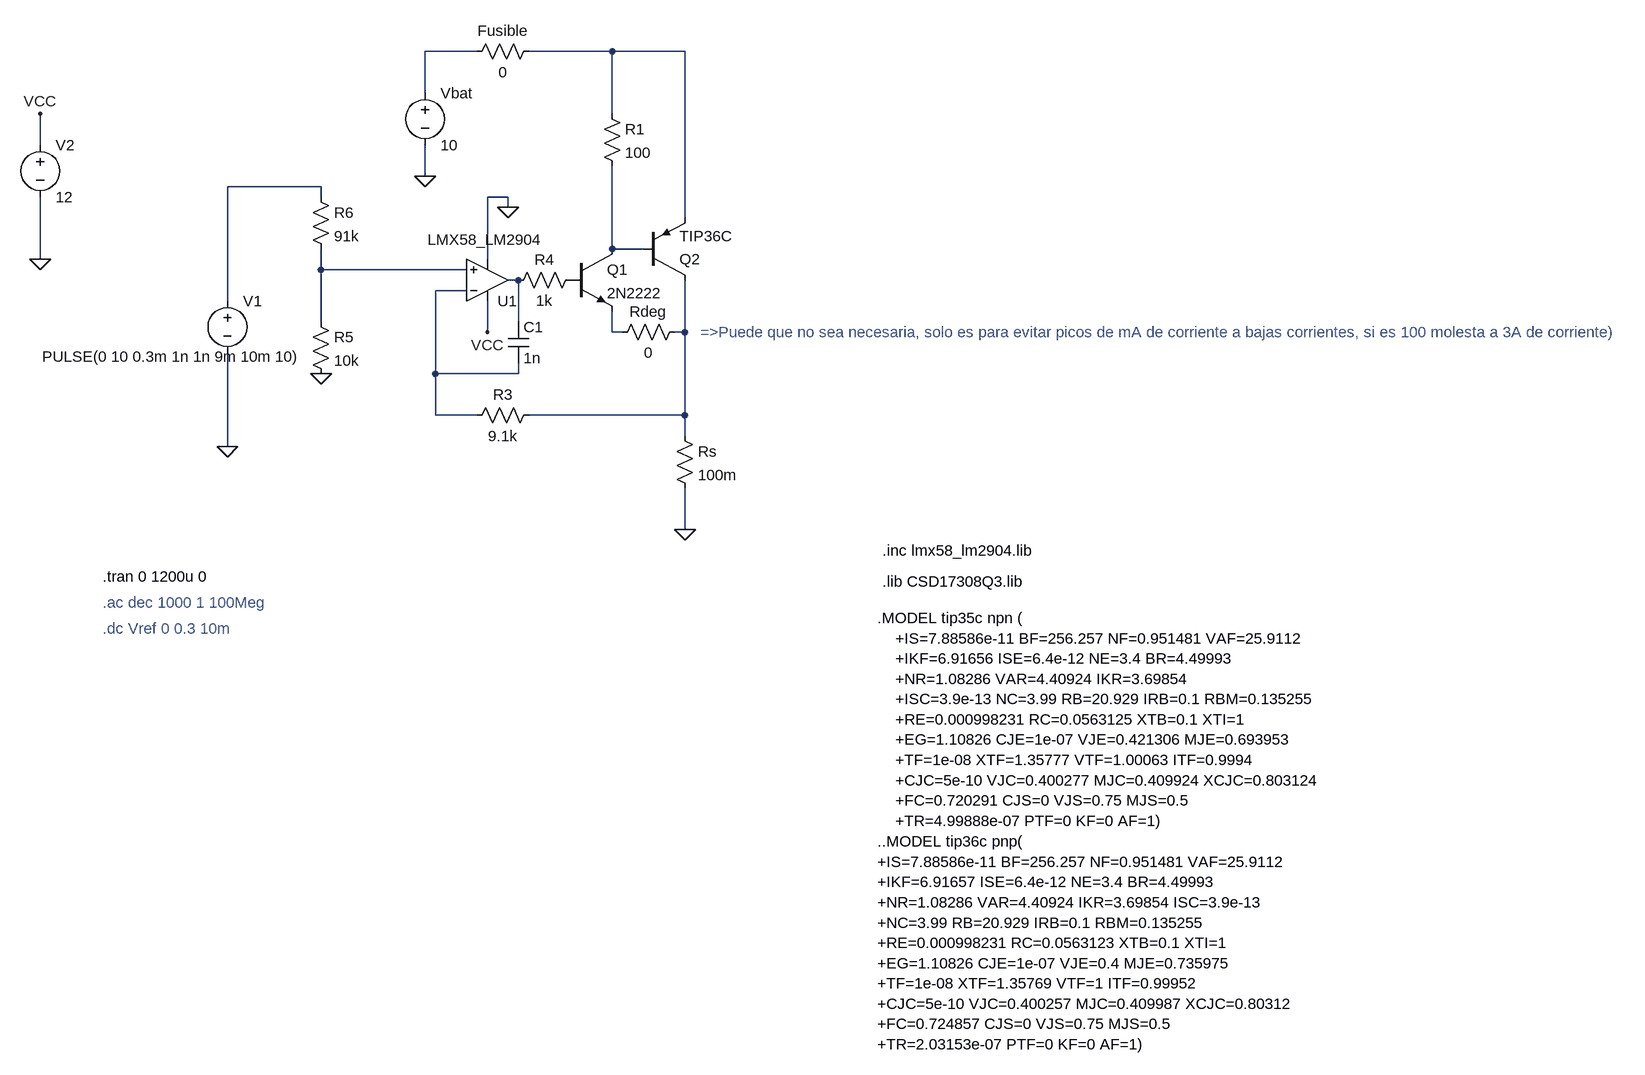
[diagram p0: schematic modulo_descarga_sziklai.asc]
modulo_descarga_sziklai.asc, the LTspice schematic file:
Version 4.1
SHEET 1 2496 680
WIRE 624 -912 544 -912
WIRE 832 -912 704 -912
WIRE 944 -912 832 -912
WIRE 544 -848 544 -912
WIRE 832 -816 832 -912
WIRE -48 -768 -48 -816
WIRE 544 -720 544 -768
WIRE 384 -704 240 -704
WIRE 384 -688 384 -704
WIRE 672 -688 640 -688
WIRE 672 -672 672 -688
WIRE 944 -656 944 -912
WIRE 832 -608 832 -736
WIRE 880 -608 832 -608
WIRE -48 -592 -48 -688
WIRE 640 -592 640 -688
WIRE 384 -576 384 -608
WIRE 608 -576 384 -576
WIRE 688 -560 672 -560
WIRE 608 -544 560 -544
WIRE 240 -528 240 -704
WIRE 384 -496 384 -576
WIRE 688 -496 688 -560
WIRE 640 -480 640 -528
WIRE 832 -480 832 -512
WIRE 848 -480 832 -480
WIRE 944 -480 944 -560
WIRE 944 -480 928 -480
WIRE 560 -416 560 -544
WIRE 688 -416 688 -432
WIRE 688 -416 560 -416
WIRE 560 -352 560 -416
WIRE 624 -352 560 -352
WIRE 944 -352 944 -480
WIRE 944 -352 704 -352
WIRE 944 -320 944 -352
WIRE 240 -304 240 -448
WIRE 944 -176 944 -240
FLAG 944 -176 0
FLAG -48 -816 VCC
FLAG -48 -592 0
FLAG 640 -480 VCC
FLAG 240 -304 0
FLAG 544 -720 0
FLAG 672 -672 0
FLAG 384 -416 0
SYMBOL OpAmps\\opamp2 640 -496 M180
WINDOW 3 -92 126 Left 2
SYMATTR Value LMX58_LM2904
SYMATTR InstName U1
SYMBOL voltage -48 -784 R0
WINDOW 123 0 0 Left 0
WINDOW 39 0 0 Left 0
SYMATTR InstName V2
SYMATTR Value 12
SYMBOL res 928 -336 R0
SYMATTR InstName Rs
SYMATTR Value 100m
SYMBOL voltage 544 -864 R0
WINDOW 123 0 0 Left 0
WINDOW 39 0 0 Left 0
SYMATTR InstName Vbat
SYMATTR Value 10
SYMBOL npn 768 -608 R0
SYMATTR InstName Q1
SYMATTR Value 2N2222
SYMBOL voltage 240 -544 R0
WINDOW 3 -285 102 Left 2
WINDOW 123 0 0 Left 0
WINDOW 39 0 0 Left 0
SYMATTR Value PULSE(0 10 0.3m 1n 1n 9m 10m 10)
SYMATTR InstName V1
SYMBOL pnp 880 -560 M180
SYMATTR InstName Q2
SYMATTR Value TIP36C
SYMBOL res 816 -832 R0
SYMATTR InstName R1
SYMATTR Value 100
SYMBOL res 608 -336 R270
WINDOW 0 32 56 VTop 2
WINDOW 3 0 56 VBottom 2
SYMATTR InstName R3
SYMATTR Value 9.1k
SYMBOL cap 672 -496 R0
SYMATTR InstName C1
SYMATTR Value 1n
SYMBOL res 784 -576 R90
WINDOW 0 0 56 VBottom 2
WINDOW 3 32 56 VTop 2
SYMATTR InstName R4
SYMATTR Value 1k
SYMBOL res 368 -512 R0
SYMATTR InstName R5
SYMATTR Value 10k
SYMBOL res 368 -704 R0
SYMATTR InstName R6
SYMATTR Value 91k
SYMBOL res 720 -928 R90
WINDOW 0 0 56 VBottom 2
WINDOW 3 32 56 VTop 2
SYMATTR InstName Fusible
SYMATTR Value 0
SYMBOL res 944 -496 R90
WINDOW 0 0 56 VBottom 2
WINDOW 3 32 56 VTop 2
SYMATTR InstName Rdeg
SYMATTR Value 0
TEXT 1248 -144 Left 2 !.inc lmx58_lm2904.lib
TEXT 48 -104 Left 2 !.tran 0 1200u 0
TEXT 48 -64 Left 2 ;.ac dec 1000 1 100Meg
TEXT 1248 -96 Left 2 !.lib CSD17308Q3.lib
TEXT 48 -24 Left 2 ;.dc Vref 0 0.3 10m
TEXT 1240 -40 Left 2 !.MODEL tip35c npn (\n    +IS=7.88586e-11 BF=256.257 NF=0.951481 VAF=25.9112\n    +IKF=6.91656 ISE=6.4e-12 NE=3.4 BR=4.49993\n    +NR=1.08286 VAR=4.40924 IKR=3.69854\n    +ISC=3.9e-13 NC=3.99 RB=20.929 IRB=0.1 RBM=0.135255\n    +RE=0.000998231 RC=0.0563125 XTB=0.1 XTI=1\n    +EG=1.10826 CJE=1e-07 VJE=0.421306 MJE=0.693953\n    +TF=1e-08 XTF=1.35777 VTF=1.00063 ITF=0.9994\n    +CJC=5e-10 VJC=0.400277 MJC=0.409924 XCJC=0.803124\n    +FC=0.720291 CJS=0 VJS=0.75 MJS=0.5\n    +TR=4.99888e-07 PTF=0 KF=0 AF=1)
TEXT 1240 304 Left 2 !..MODEL tip36c pnp(\n+IS=7.88586e-11 BF=256.257 NF=0.951481 VAF=25.9112\n+IKF=6.91657 ISE=6.4e-12 NE=3.4 BR=4.49993\n+NR=1.08286 VAR=4.40924 IKR=3.69854 ISC=3.9e-13\n+NC=3.99 RB=20.929 IRB=0.1 RBM=0.135255\n+RE=0.000998231 RC=0.0563123 XTB=0.1 XTI=1\n+EG=1.10826 CJE=1e-07 VJE=0.4 MJE=0.735975\n+TF=1e-08 XTF=1.35769 VTF=1 ITF=0.99952\n+CJC=5e-10 VJC=0.400257 MJC=0.409987 XCJC=0.80312\n+FC=0.724857 CJS=0 VJS=0.75 MJS=0.5\n+TR=2.03153e-07 PTF=0 KF=0 AF=1)
TEXT 968 -480 Left 2 ;=>Puede que no sea necesaria, solo es para evitar picos de mA de corriente a bajas corrientes, si es 100 molesta a 3A de corriente)

The netlist it stands for:
* modulo_descarga_sziklai.asc
X§U1 N005 N007 VCC 0 N006 LMX58_LM2904  ; pins In+ In- V+ V- OUT
V2 VCC 0 12
Rs N009 0 100m
Vbat N001 0 10
Q1 N004 P001 N008 0 2N2222
V1 N003 0 PULSE(0 10 0.3m 1n 1n 9m 10m 10)
Q2 N009 N004 N002 0 TIP36C
R1 N002 N004 100
R3 N007 N009 9.1k
C1 N006 N007 1n
R4 P001 N006 1k
R5 N005 0 10k
R6 N003 N005 91k
R§Fusible N002 N001 0
Rdeg N009 N008 0
.model NPN NPN
.model PNP PNP
.lib standard.bjt
.inc lmx58_lm2904.lib
.tran 0 1200u 0
* .ac dec 1000 1 100Meg
.lib CSD17308Q3.lib
* .dc Vref 0 0.3 10m
.MODEL tip35c npn (
    +IS=7.88586e-11 BF=256.257 NF=0.951481 VAF=25.9112
    +IKF=6.91656 ISE=6.4e-12 NE=3.4 BR=4.49993
    +NR=1.08286 VAR=4.40924 IKR=3.69854
    +ISC=3.9e-13 NC=3.99 RB=20.929 IRB=0.1 RBM=0.135255
    +RE=0.000998231 RC=0.0563125 XTB=0.1 XTI=1
    +EG=1.10826 CJE=1e-07 VJE=0.421306 MJE=0.693953
    +TF=1e-08 XTF=1.35777 VTF=1.00063 ITF=0.9994
    +CJC=5e-10 VJC=0.400277 MJC=0.409924 XCJC=0.803124
    +FC=0.720291 CJS=0 VJS=0.75 MJS=0.5
    +TR=4.99888e-07 PTF=0 KF=0 AF=1)
..MODEL tip36c pnp(
+IS=7.88586e-11 BF=256.257 NF=0.951481 VAF=25.9112
+IKF=6.91657 ISE=6.4e-12 NE=3.4 BR=4.49993
+NR=1.08286 VAR=4.40924 IKR=3.69854 ISC=3.9e-13
+NC=3.99 RB=20.929 IRB=0.1 RBM=0.135255
+RE=0.000998231 RC=0.0563123 XTB=0.1 XTI=1
+EG=1.10826 CJE=1e-07 VJE=0.4 MJE=0.735975
+TF=1e-08 XTF=1.35769 VTF=1 ITF=0.99952
+CJC=5e-10 VJC=0.400257 MJC=0.409987 XCJC=0.80312
+FC=0.724857 CJS=0 VJS=0.75 MJS=0.5
+TR=2.03153e-07 PTF=0 KF=0 AF=1)
* =>Puede que no sea necesaria, solo es para evitar picos de mA de corriente a bajas corrientes, si es 100 molesta a 3A de corriente)
.backanno
.end